# Altium project SMS.PrjPCB
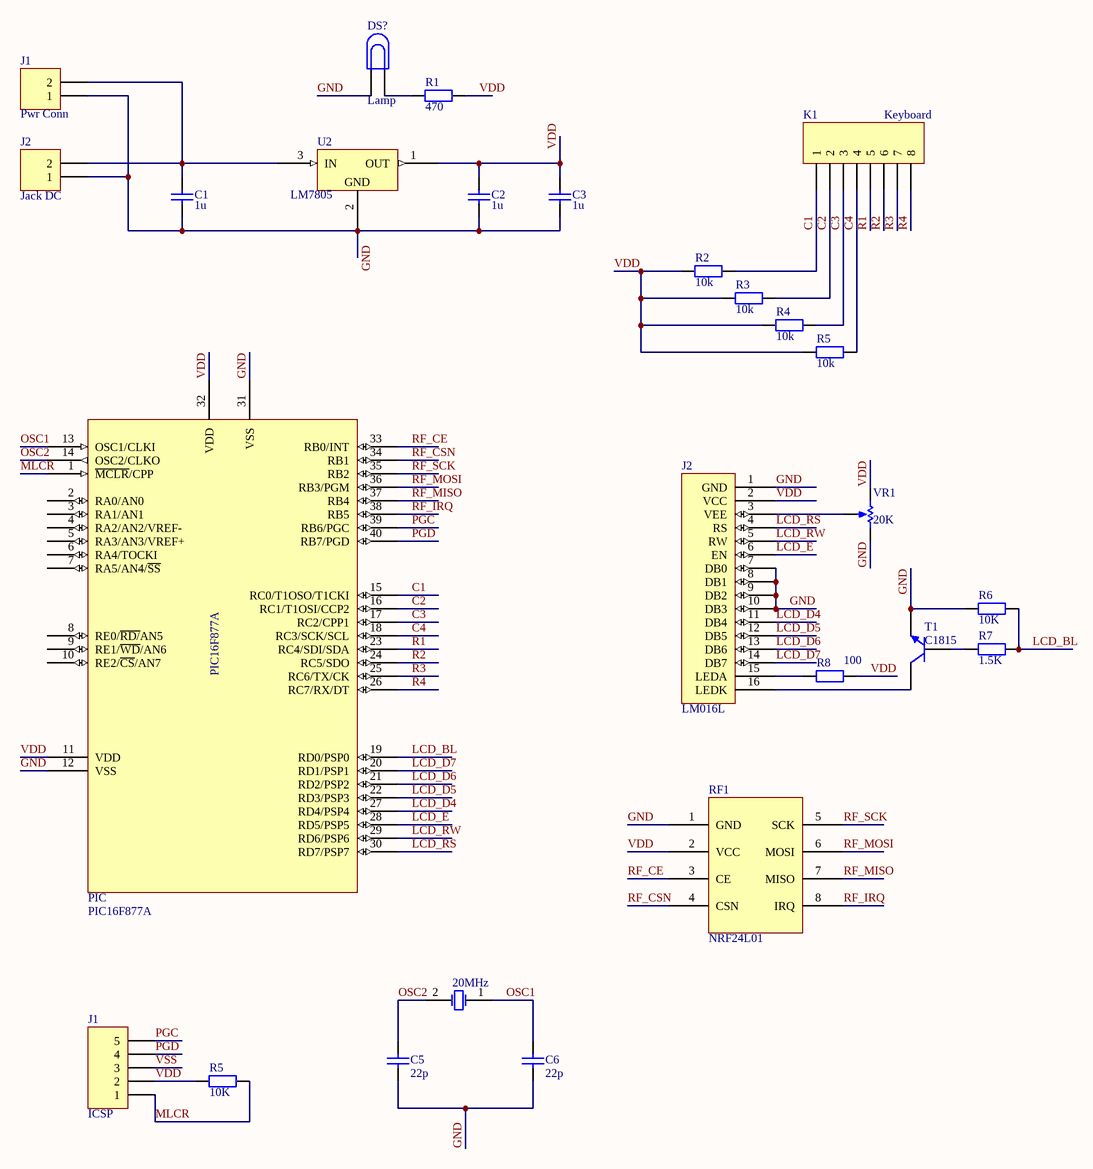
[diagram p0: SMO_Schematic.SchDoc]
1 sheet, 26 parts. Net scope: global (net labels, ports and power ports of the same name join across sheets).
Board files: SMO.PcbDoc, SMR.PCBDOC, SMC.PCBDOC

## Sheet SMO_Schematic.SchDoc: Ban thiet ke Schematic thiet bi SMO
size B; Author: Lê Cao Minh Thành; DrawnBy: Lê Cao Minh Thành; DocumentNumber: 01; CurrentDate: 11/09/2012; DocumentName: SMO Schematic

### Parts
(Parts that share a designator on the sheet are numbered #1, #2 ... from top to bottom, then left to right.)
20MHz  XTAL  [BCY-W2/D3.1]  (value not drawn)
C1  value 1u  [RAD-0.3]
C2  value 1u  [RAD-0.3]
C3  value 1u  [RAD-0.3]
C5  value 22p  [RAD-0.3]  (hidden comment: Cap)
C6  value 22p  [RAD-0.3]  (hidden comment: Cap)
DS?  Lamp  [PIN2]
J1#1  Pwr Conn  [HDR1X2H]
J1#2  ICSP  [HDR1X5]
J2#1  Jack DC  [HDR1X2]
J2#2  LM016L  [LM016L]
K1  Keyboard  [HDR1X8]
PIC  PIC16F877A  [PIC16F877A]
R1  value 470  [AXIAL-0.4]  (hidden comment: Res1)
R2  value 10k  [AXIAL-0.4]  (hidden comment: Res1)
R3  value 10k  [AXIAL-0.4]  (hidden comment: Res1)
R4  value 10k  [AXIAL-0.4]  (hidden comment: Res1)
R5#1  value 10k  [AXIAL-0.4]  (hidden comment: Res1)
R5#2  value 10K  [AXIAL-0.4]  (hidden comment: Res2)
R6  value 10K  [AXIAL-0.4]  (hidden comment: Res2)
R7  value 1.5K  [AXIAL-0.4]  (hidden comment: Res2)
R8  value 100  [AXIAL-0.4]  (hidden comment: Res2)
RF1  NRF24L01  [NRF24L01]
T1  C1815  [BCY-W3]
U2  LM7805  [LM7805]
VR1  value 20K  [VR5]  (hidden comment: RPot1)

### Nets
C1: K1.1 PIC.15(RC0/T1OSO/T1CKI) R2.2
C2: K1.2 PIC.16(RC1/T1OSI/CCP2) R3.2
C3: K1.3 PIC.17(RC2/CPP1) R4.2
C4: K1.4 PIC.18(RC3/SCK/SCL) R5#1.2
GND: C1.1 C2.1 C3.1 C5.1 C6.1 DS?.1 J1#1.1 J2#1.1 J2#2.1(GND) J2#2.7(DB0) J2#2.8(DB1) J2#2.9(DB2) J2#2.10(DB3) PIC.12(VSS) PIC.31(VSS) R6.1 RF1.1(GND) T1.3(E) U2.2(GND) VR1.2(BOT)
LCD_BL: PIC.19(RD0/PSP0) R6.2 R7.2
LCD_D4: J2#2.11(DB4) PIC.27(RD4/PSP4)
LCD_D5: J2#2.12(DB5) PIC.22(RD3/PSP3)
LCD_D6: J2#2.13(DB6) PIC.21(RD2/PSP2)
LCD_D7: J2#2.14(DB7) PIC.20(RD1/PSP1)
LCD_E: J2#2.6(EN) PIC.28(RD5/PSP5)
LCD_RS: J2#2.4(RS) PIC.30(RD7/PSP7)
LCD_RW: J2#2.5(RW) PIC.29(RD6/PSP6)
MLCR: J1#2.1 PIC.1(~{MCLR}/CPP) R5#2.2
OSC1: 20MHz.1(OSC1) C6.2 PIC.13(OSC1/CLKI)
OSC2: 20MHz.2(OSC2) C5.2 PIC.14(OSC2/CLKO)
PGC: J1#2.5 PIC.39(RB6/PGC)
PGD: J1#2.4 PIC.40(RB7/PGD)
R1: K1.5 PIC.23(RC4/SDI/SDA)
R2: K1.6 PIC.24(RC5/SDO)
R3: K1.7 PIC.25(RC6/TX/CK)
R4: K1.8 PIC.26(RC7/RX/DT)
RF_CE: PIC.33(RB0/INT) RF1.3(CE)
RF_CSN: PIC.34(RB1) RF1.4(CSN)
RF_IRQ: PIC.38(RB5) RF1.8(IRQ)
RF_MISO: PIC.37(RB4) RF1.7(MISO)
RF_MOSI: PIC.36(RB3/PGM) RF1.6(MOSI)
RF_SCK: PIC.35(RB2) RF1.5(SCK)
VDD: C2.2 C3.2 J1#2.2 J2#2.2(VCC) PIC.11(VDD) PIC.32(VDD) R1.2 R2.1 R3.1 R4.1 R5#1.1 R5#2.1 R8.2 RF1.2(VCC) U2.1(OUT) VR1.1(TOP)
VSS: J1#2.3
NetC1_2: C1.2 J1#1.2 J2#1.2 U2.3(IN)
NetDS?_2: DS?.2 R1.1
NetJ2#2_3: J2#2.3(VEE) VR1.3(TAP)
NetJ2#2_15: J2#2.15(LEDA) R8.1
NetJ2#2_16: J2#2.16(LEDK) T1.1(C)
NetR7_1: R7.1 T1.2(B)

Not connected (* = marked no-connect by the designer): PIC 2(RA0/AN0) 3(RA1/AN1) 4(RA2/AN2/VREF-) 5(RA3/AN3/VREF+) 6(RA4/TOCKI) 7(RA5/AN4/~{SS}) 8(RE0/~{RD/}AN5) 9(RE1/~{WD}/AN6) 10(RE2/~{CS}/AN7)

### Library data of the parts
20MHz = XTAL: Crystal Oscillator; Manufacturer: Generic Components; Published: 08/06/2000; Publisher: Altium Hobart Technology Centre; Class: Oscillator; SubClass: Crystal Oscillator
C1-C3 C5 C6 = Cap: Capacitor; Manufacturer: Generic Components; Class: Passive; Published: 08/06/2000; Publisher: Altium Hobart Technology Centre; SubClass: Capacitor
DS? = Lamp: Incandescent Bulb; Manufacturer: Generic Components; Published: 1999
J1#1 = Header 2H: Header, 2-Pin,  Right Angle; Manufacturer: Generic Components; Class: Connector
J1#2 = Header 5: Header, 5-Pin; Manufacturer: Generic Components; Class: Connector
J2#1 = Header 2: Header, 2-Pin; Manufacturer: Generic Components; Class: Connector
K1 = Header 8: Header, 8-Pin; Manufacturer: Generic Components; Class: Connector
R1-R4 R5#1 R5#2 R6-R8 = Res2: Resistor; Manufacturer: Generic Components; Class: Passive; Published: 08/06/2000; Publisher: Altium Hobart Technology Centre; SubClass: Resistor
T1 = NPN: NPN Bipolar Transistor; Manufacturer: Generic Components; Class: Discrete; SubClass: BJT - Low Power; Published: 08/06/2000; Publisher: Altium Hobart Technology Centre
VR1 = RPot1: Potentiometer; Manufacturer: Generic Components; Class: Passive; Set Position: 0.5; Published: 08/06/2000; Publisher: Altium Hobart Technology Centre; SubClass: Potentiometer